# EAGLE design programmer (EAGLE 7.2.0)
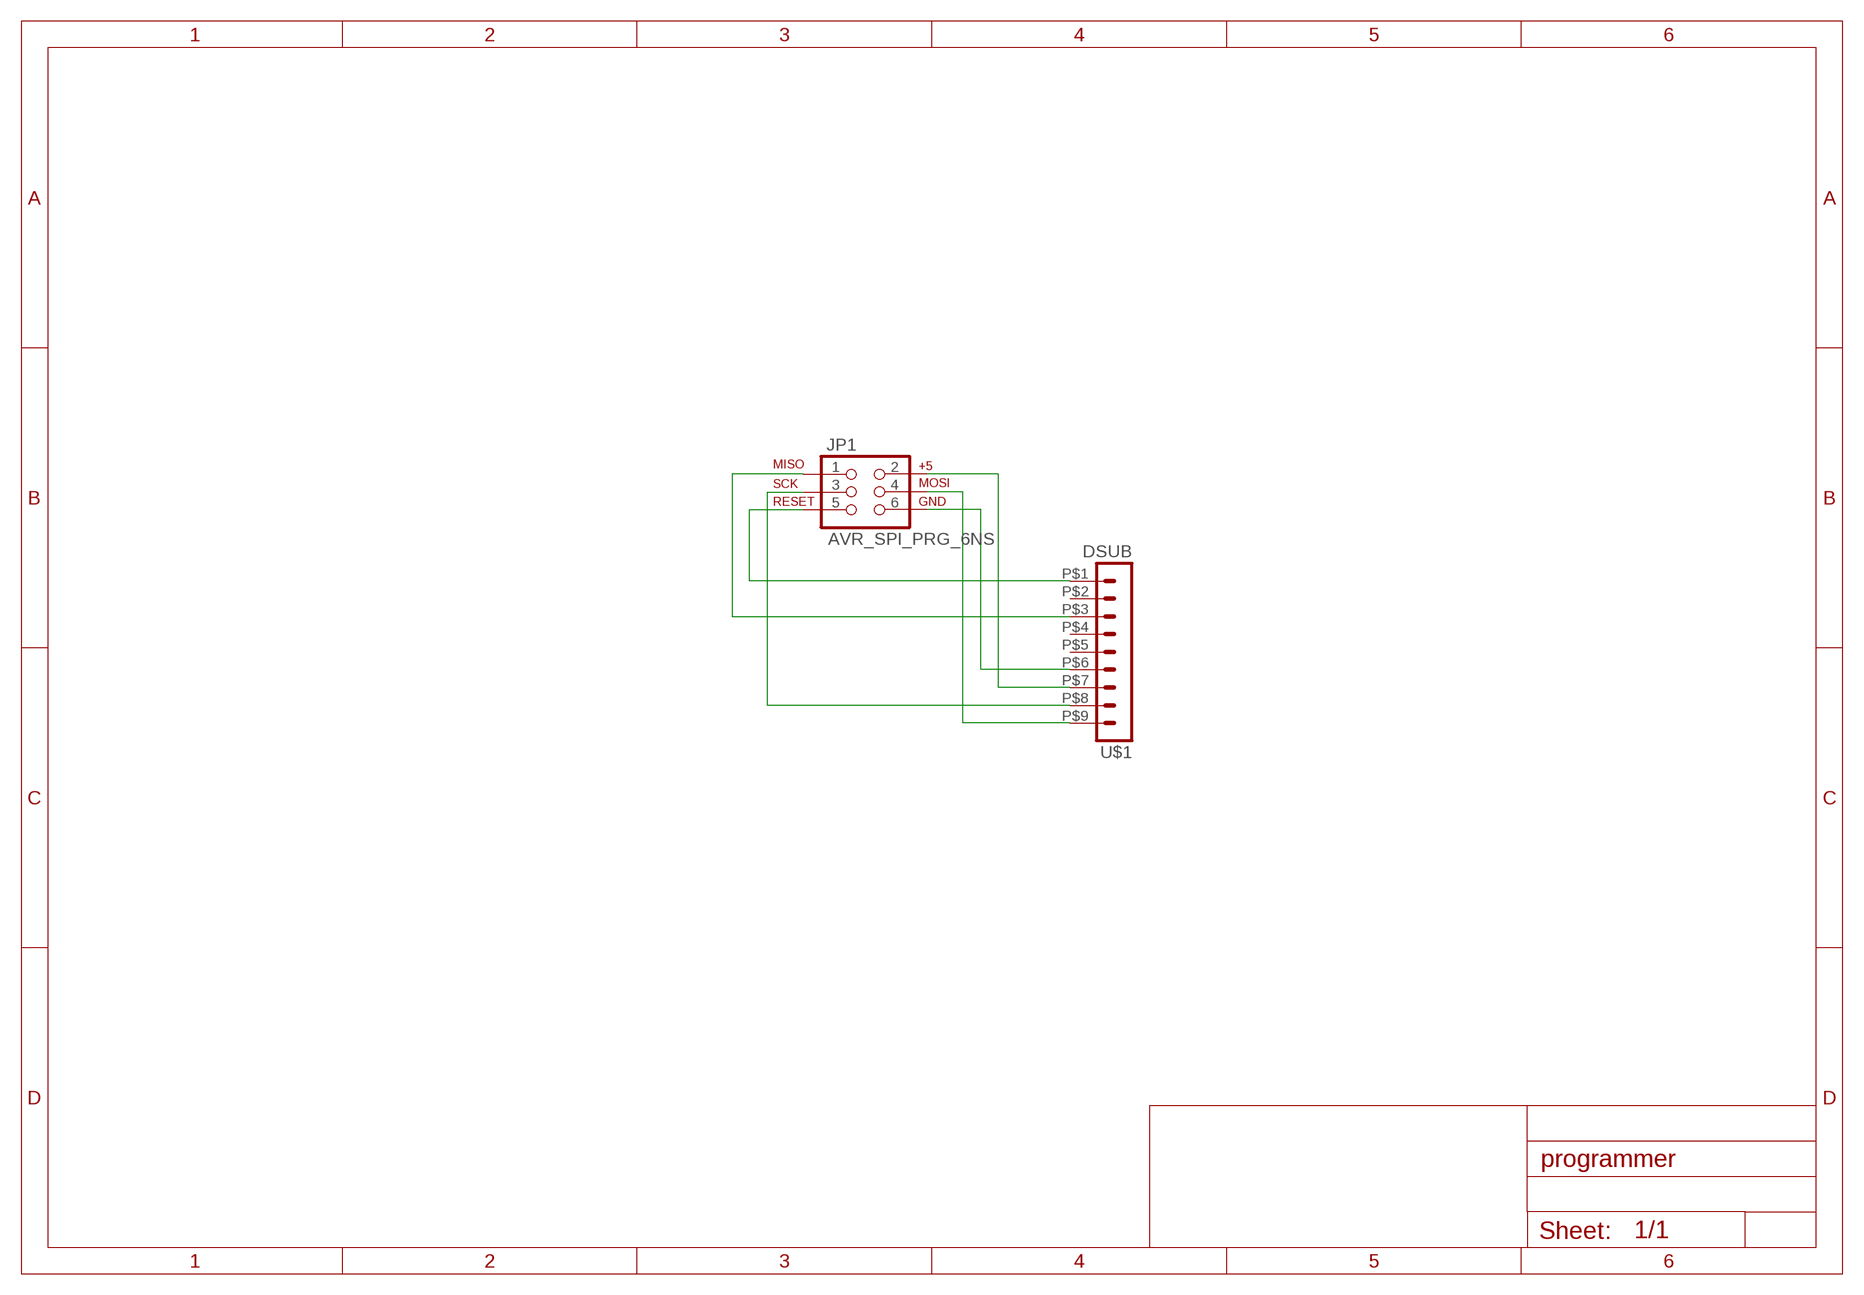
[diagram p0: schematic, sheet 1]

## Parts
JP1  AVR_SPI_PRG_6NS  [2X3-NS]
U$1  DSUB  [FOUR]

## Nets
GND: JP1.6 U$1.P$6
MISO: JP1.1 U$1.P$3
MOSI: JP1.4 U$1.P$9
RESET: JP1.5 U$1.P$1
SCK: JP1.3 U$1.P$8
VCC: JP1.2 U$1.P$7
Unconnected: U$1.P$2 U$1.P$4 U$1.P$5

## Library data of the parts
JP1 = SparkFun-Connectors:AVR_SPI_PRG_6: AVR ISP 6 Pin This is the reduced ISP connector for AVR programming. Common on Arduino. This footprint will take up less PCB space and can be used with a 10-pin to 6-pin adapter such as SKU: BOB-08508 **Special note about "TEST_POINT" package. The stop mask is on the top side, so if you want your programming test points to be on the bottom of your board, make sure to place this package on the bottom side of the board. This also ensure that the orientation to program from the bottom side will be correct.
U$1 = custom:DSUB: Side mount for DB9 connector.

## Board
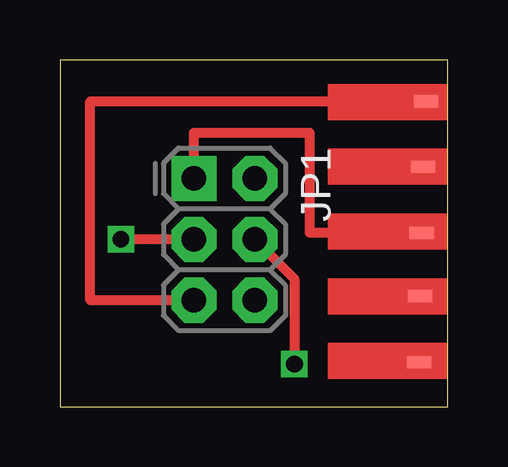
[diagram p1: board, top side]
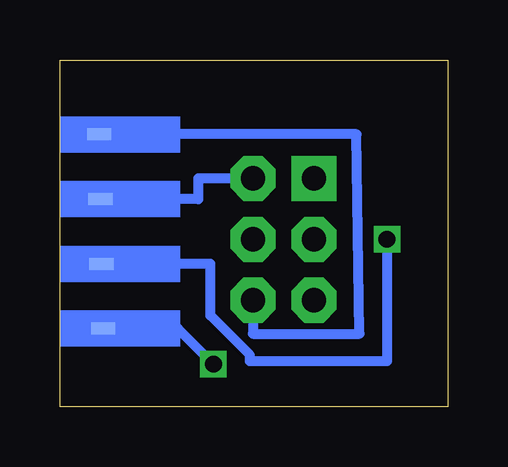
[diagram p2: board, bottom side, seen from below]

Size 16.18 x 14.47 mm. Coordinates in mm from the lower left corner, seen from the top.
Outline: 0,0 16.18,0 16.18,14.47 0,14.47 0,0
Copper layers (1*16): Top 0.035mm / dielectric 1.5mm / Bottom 0.035mm
Design rules "default": minimum track width 10mil, minimum drill 24mil, track to track 8mil, track to pad 8mil, pad to pad 8mil, via to via 8mil, smd to smd 8mil, copper to edge 40mil, drill to drill 8mil, minimum pad ring 10mil, minimum via ring 8mil, stop-mask expansion 4mil, vias tented up to drill 0mil, thermal gap 10mil

### Footprints (pad centres in the part's own frame; a part is rotated, then mirrored left to right if it is on the bottom)
2X3-NS = drill 1.016 pad 1.88 square: 1 -2.54,-1.27 | drill 1.016 pad 1.88 octagon: 2 -2.54,1.27; 3 0,-1.27; 4 0,1.27; 5 2.54,-1.27; 6 2.54,1.27
FOUR = smd 0.508 x 1.016: P$1 0.72,4.1; P$2 3.44,3.97; P$3 6.2,3.9; P$4 8.85,3.85; P$5 11.61,3.8 | smd 0.508 x 1.016 bottom: P$6 2.09,3.37; P$7 4.8,3.31; P$8 7.5,3.27; P$9 10.19,3.2

### Placement (x,y rotation side)
JP1  6.86,6.99 270 top
U$1  11.18,13.46 270 top

### Tracks (layer width: path | path; a pad name or v marks a point on that pad's centre or on a via)
GND
  Bottom 0.406: JP1.6 8.13,3.05 3.68,3.05 3.81,11.37 U$1.P$6
MISO
  Top 0.406: JP1.1 5.59,11.43 10.41,11.43 10.41,7.26 U$1.P$3
MOSI  (via drill 0.7)
  Top 0.406: JP1.4 9.78,5.33 v9.78,1.78
  Bottom 0.406: v9.78,1.78 11.27,3.27 U$1.P$9
RESET
  Top 0.406: JP1.5 1.27,4.45 1.27,12.74 U$1.P$1
SCK  (via drill 0.7)
  Top 0.406: JP1.3 v2.54,6.99
  Bottom 0.406: v2.54,6.99 2.54,1.91 8.26,1.91 8.26,2.16 9.91,3.81 9.91,5.96 U$1.P$8
VCC
  Bottom 0.406: JP1.2 10.41,9.53 10.41,8.66 U$1.P$7